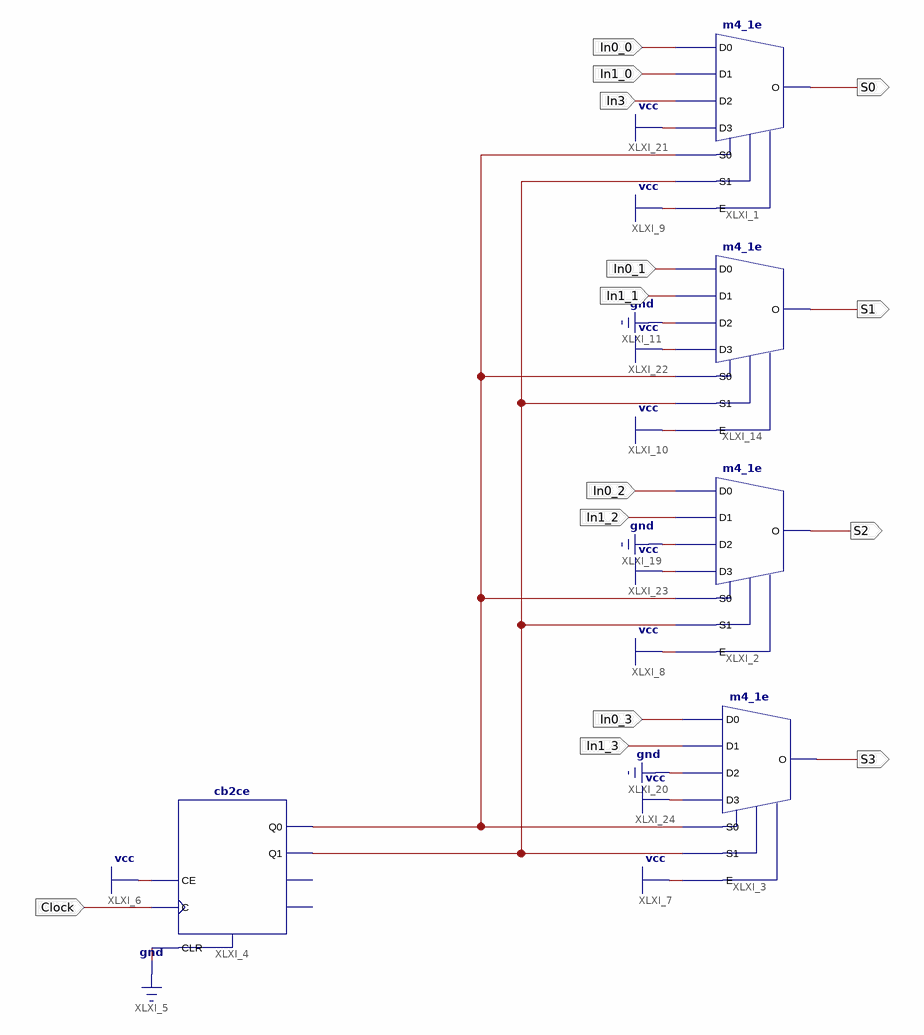
[diagram p0: schematic sheet 1]
// Xilinx ISE schematic mux16_4.sch (spartan6) as structural Verilog: 5 symbols, 14 ports
module mux16_4 (
  input  In0_0,
  input  In0_2,
  input  In0_3,
  input  In1_0,
  input  In1_2,
  input  In1_3,
  input  Clock,
  input  In3,
  input  In1_1,
  input  In0_1,
  output S3,
  output S2,
  output S1,
  output S0
);

  wire XLXN_42, XLXN_43;

  m4_1e XLXI_1 (.D0(In0_0), .D1(In1_0), .D2(In3), .D3(1'b1), .E(1'b1), .S0(XLXN_43), .S1(XLXN_42), .O(S0));
  m4_1e XLXI_2 (.D0(In0_2), .D1(In1_2), .D2(1'b0), .D3(1'b1), .E(1'b1), .S0(XLXN_43), .S1(XLXN_42), .O(S2));
  m4_1e XLXI_3 (.D0(In0_3), .D1(In1_3), .D2(1'b0), .D3(1'b1), .E(1'b1), .S0(XLXN_43), .S1(XLXN_42), .O(S3));
  cb2ce XLXI_4 (.C(Clock), .CE(1'b1), .CLR(1'b0), .Q0(XLXN_43), .Q1(XLXN_42));  // open: CEO, TC
  m4_1e XLXI_14 (.D0(In0_1), .D1(In1_1), .D2(1'b0), .D3(1'b1), .E(1'b1), .S0(XLXN_43), .S1(XLXN_42), .O(S1));
endmodule
